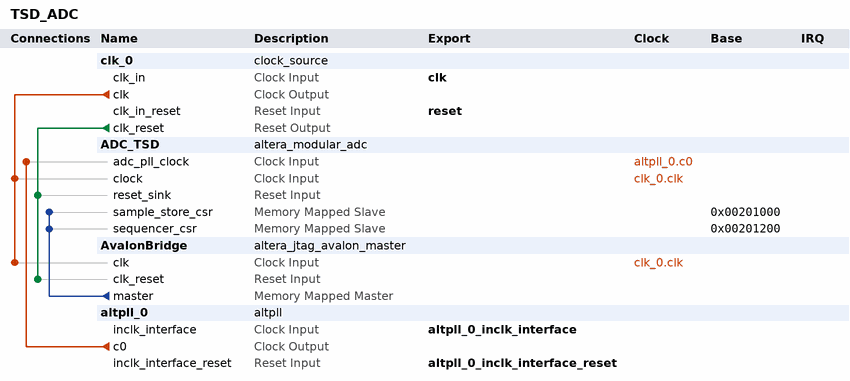
[diagram p0: system contents]
# Platform Designer (Qsys) system TSD_ADC, MAX 10 10M50DAF484C7G
# Parameters at their usual value, and those the tool derives, are not listed.
package require -exact qsys 22.1
create_system TSD_ADC
set_project_property DEVICE_FAMILY {MAX 10}
set_project_property DEVICE 10M50DAF484C7G

add_instance clk_0 clock_source 22.1
set_instance_parameter_value clk_0 clockFrequency 50000000

add_instance ADC_TSD altera_modular_adc 22.1
set_instance_parameter_value ADC_TSD CLOCK_FREQ 50000000
set_instance_parameter_value ADC_TSD CORE_VAR 0
set_instance_parameter_value ADC_TSD DEVICE_PART 10M50DAF484C7G
set_instance_parameter_value ADC_TSD clkdiv 2
set_instance_parameter_value ADC_TSD int_vref_vr 3.0
set_instance_parameter_value ADC_TSD refsel 1
set_instance_parameter_value ADC_TSD sample_rate 0
set_instance_parameter_value ADC_TSD seq_order_length 1
set_instance_parameter_value ADC_TSD seq_order_slot_1 17
set_instance_parameter_value ADC_TSD seq_order_slot_2 30
set_instance_parameter_value ADC_TSD seq_order_slot_3 30
set_instance_parameter_value ADC_TSD seq_order_slot_4 30
set_instance_parameter_value ADC_TSD seq_order_slot_5 30
set_instance_parameter_value ADC_TSD seq_order_slot_6 30
set_instance_parameter_value ADC_TSD seq_order_slot_7 30
set_instance_parameter_value ADC_TSD use_ch0 false
set_instance_parameter_value ADC_TSD use_ch1 false
set_instance_parameter_value ADC_TSD use_ch2 false
set_instance_parameter_value ADC_TSD use_ch3 false
set_instance_parameter_value ADC_TSD use_ch4 false
set_instance_parameter_value ADC_TSD use_ch5 false
set_instance_parameter_value ADC_TSD use_ch6 false
set_instance_parameter_value ADC_TSD use_ch7 false
set_instance_parameter_value ADC_TSD use_ch8 false
set_instance_parameter_value ADC_TSD use_tsd true

add_instance AvalonBridge altera_jtag_avalon_master 22.1

add_instance altpll_0 altpll 22.1
set_instance_parameter_value altpll_0 CLK0_DIVIDE_BY 5
set_instance_parameter_value altpll_0 CLK0_MULTIPLY_BY 1
set_instance_parameter_value altpll_0 INCLK0_INPUT_FREQUENCY 20000
set_instance_parameter_value altpll_0 PORT_ARESET PORT_UNUSED
set_instance_parameter_value altpll_0 PORT_LOCKED PORT_USED
set_instance_parameter_value altpll_0 PORT_clk1 PORT_UNUSED
set_instance_parameter_value altpll_0 PORT_clk2 PORT_UNUSED
set_instance_parameter_value altpll_0 PORT_clk3 PORT_UNUSED

# connections
add_connection altpll_0.c0 ADC_TSD.adc_pll_clock clock
add_connection clk_0.clk ADC_TSD.clock clock
add_connection clk_0.clk AvalonBridge.clk clock
add_connection clk_0.clk_reset ADC_TSD.reset_sink reset
add_connection clk_0.clk_reset AvalonBridge.clk_reset reset
add_connection AvalonBridge.master ADC_TSD.sample_store_csr avalon
set_connection_parameter_value AvalonBridge.master/ADC_TSD.sample_store_csr baseAddress 0x00201000
add_connection AvalonBridge.master ADC_TSD.sequencer_csr avalon
set_connection_parameter_value AvalonBridge.master/ADC_TSD.sequencer_csr baseAddress 0x00201200

# exported interfaces
add_interface altpll_0_inclk_interface clock sink
set_interface_property altpll_0_inclk_interface EXPORT_OF altpll_0.inclk_interface
add_interface altpll_0_inclk_interface_reset reset sink
set_interface_property altpll_0_inclk_interface_reset EXPORT_OF altpll_0.inclk_interface_reset
add_interface clk clock sink
set_interface_property clk EXPORT_OF clk_0.clk_in
add_interface reset reset sink
set_interface_property reset EXPORT_OF clk_0.clk_in_reset

set_interconnect_requirement {$system} qsys_mm.clockCrossingAdapter HANDSHAKE
set_interconnect_requirement {$system} qsys_mm.enableEccProtection FALSE
set_interconnect_requirement {$system} qsys_mm.insertDefaultSlave FALSE
set_interconnect_requirement {$system} qsys_mm.maxAdditionalLatency 1

save_system TSD_ADC.qsys
